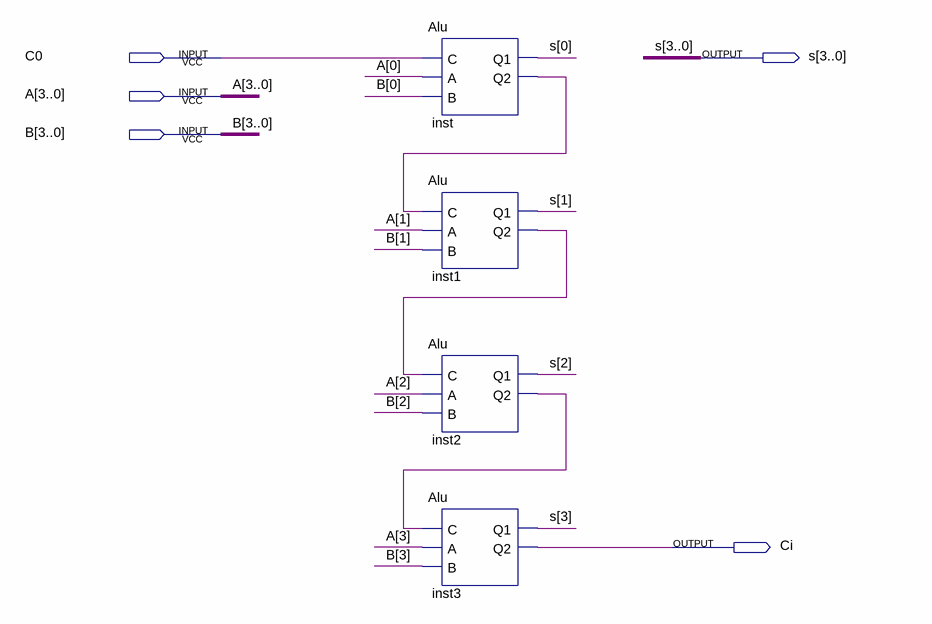
[diagram p0: schematic sheet]
// Quartus schematic arif.bdf as structural Verilog: 4 symbols, 5 pins
module arif (
  input  C0,
  input  [3:0] A,
  input  [3:0] B,
  output [3:0] s,
  output Ci
);

  wire inst1_q2, inst2_q2, inst_q2;

  Alu inst (.C(C0), .A(A[0]), .B(B[0]), .Q1(s[0]), .Q2(inst_q2));
  Alu inst1 (.C(inst_q2), .A(A[1]), .B(B[1]), .Q1(s[1]), .Q2(inst1_q2));
  Alu inst2 (.C(inst1_q2), .A(A[2]), .B(B[2]), .Q1(s[2]), .Q2(inst2_q2));
  Alu inst3 (.C(inst2_q2), .A(A[3]), .B(B[3]), .Q1(s[3]), .Q2(Ci));
endmodule
